# Altium schematic sheet QUTMS-BrakeLight-S00-V00.SchDoc: Brake Light
size A3; DrawnBy: Joseph Richards; DocumentNumber: 1; SheetNumber: 1; SheetTotal: 1
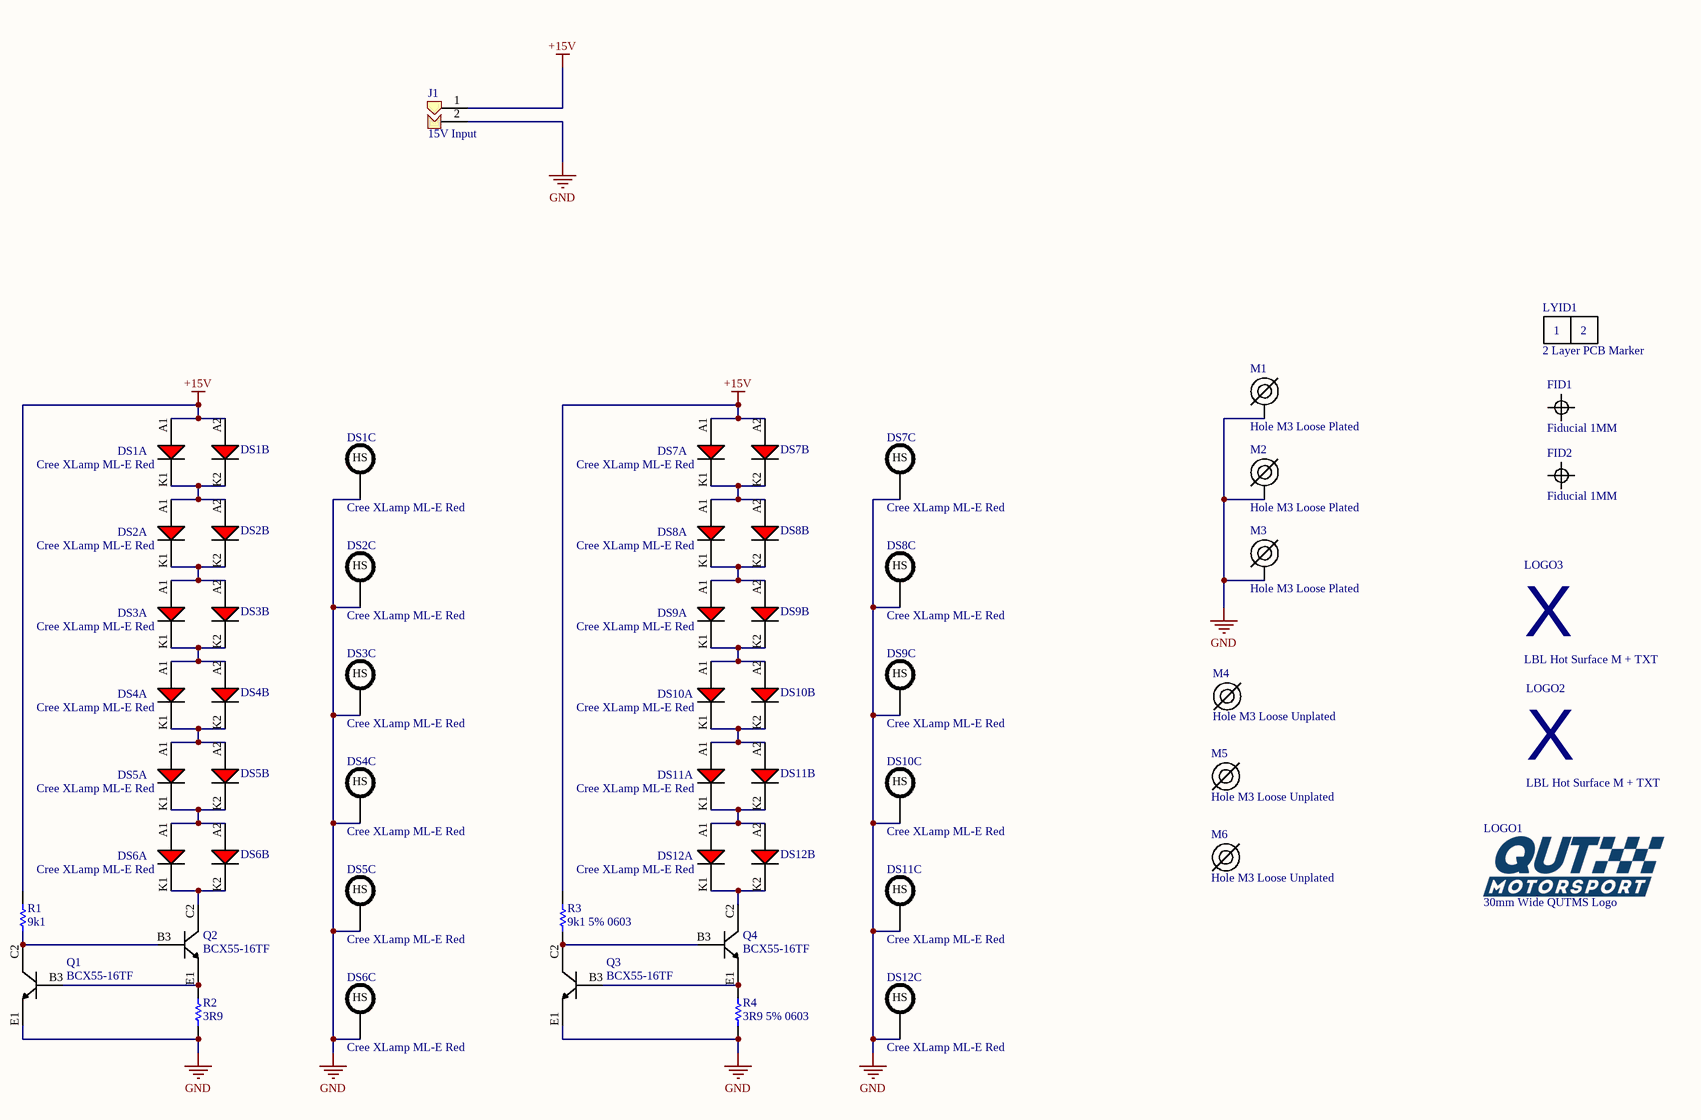
[diagram p0: QUTMS-BrakeLight-S00-V00.SchDoc]

## Parts
DS1  Cree XLamp ML-E Red  [CREE XLAMP ML-E]  (parts A,B,C of 3)
DS2  Cree XLamp ML-E Red  [CREE XLAMP ML-E]  (parts A,B,C of 3)
DS3  Cree XLamp ML-E Red  [CREE XLAMP ML-E]  (parts A,B,C of 3)
DS4  Cree XLamp ML-E Red  [CREE XLAMP ML-E]  (parts A,B,C of 3)
DS5  Cree XLamp ML-E Red  [CREE XLAMP ML-E]  (parts A,B,C of 3)
DS6  Cree XLamp ML-E Red  [CREE XLAMP ML-E]  (parts A,B,C of 3)
DS7  Cree XLamp ML-E Red  [CREE XLAMP ML-E]  (parts A,B,C of 3)
DS8  Cree XLamp ML-E Red  [CREE XLAMP ML-E]  (parts A,B,C of 3)
DS9  Cree XLamp ML-E Red  [CREE XLAMP ML-E]  (parts A,B,C of 3)
DS10  Cree XLamp ML-E Red  [CREE XLAMP ML-E]  (parts A,B,C of 3)
DS11  Cree XLamp ML-E Red  [CREE XLAMP ML-E]  (parts A,B,C of 3)
DS12  Cree XLamp ML-E Red  [CREE XLAMP ML-E]  (parts A,B,C of 3)
FID1  Fiducial 1MM  [FIDUCIAL 1MM]
FID2  Fiducial 1MM  [FIDUCIAL 1MM]
J1  15V Input  [Jumper_2Way_Large_Solder_Pad]
LOGO1  30mm Wide QUTMS Logo  [QUTMS LOGO 30MM]
LOGO2  LBL Hot Surface M + TXT  [LBL HOT MEDIUM TXT]
LOGO3  LBL Hot Surface M + TXT  [LBL HOT MEDIUM TXT]
LYID1  2 Layer PCB Marker  [LAYER IDENT 2]
M1  Hole M3 Loose Plated  [M3.5 PLATED]
M2  Hole M3 Loose Plated  [M3.5 PLATED]
M3  Hole M3 Loose Plated  [M3.5 PLATED]
M4  Hole M3 Loose Unplated  [M3.5 UNPLATED]
M5  Hole M3 Loose Unplated  [M3.5 UNPLATED]
M6  Hole M3 Loose Unplated  [M3.5 UNPLATED]
Q1  BCX55-16TF  [SOT89]
Q2  BCX55-16TF  [SOT89]
Q3  BCX55-16TF  [SOT89]
Q4  BCX55-16TF  [SOT89]
R1  9k1  [Res_ThinFilm_0603]
R2  3R9  [Res_ThinFilm_0603]
R3  9k1 5% 0603  [Res_ThinFilm_0603]
R4  3R9 5% 0603  [Res_ThinFilm_0603]

## Nets
+15V: DS1.A1(A) DS1.A2(A) DS7.A1(A) DS7.A2(A) J1.1 R1.1 R3.1
GND: DS1.HS DS2.HS DS3.HS DS4.HS DS5.HS DS6.HS DS7.HS DS8.HS DS9.HS DS10.HS DS11.HS DS12.HS J1.2 M1.1 M2.1 M3.1 Q1.E1 Q3.E1 R2.1 R4.1
NetDS1_K1: DS1.K1(K) DS1.K2(K) DS2.A1(A) DS2.A2(A)
NetDS2_K1: DS2.K1(K) DS2.K2(K) DS3.A1(A) DS3.A2(A)
NetDS3_K1: DS3.K1(K) DS3.K2(K) DS4.A1(A) DS4.A2(A)
NetDS4_K1: DS4.K1(K) DS4.K2(K) DS5.A1(A) DS5.A2(A)
NetDS5_K1: DS5.K1(K) DS5.K2(K) DS6.A1(A) DS6.A2(A)
NetDS6_K1: DS6.K1(K) DS6.K2(K) Q2.C2
NetDS7_K1: DS7.K1(K) DS7.K2(K) DS8.A1(A) DS8.A2(A)
NetDS8_K1: DS8.K1(K) DS8.K2(K) DS9.A1(A) DS9.A2(A)
NetDS9_K1: DS9.K1(K) DS9.K2(K) DS10.A1(A) DS10.A2(A)
NetDS10_K1: DS10.K1(K) DS10.K2(K) DS11.A1(A) DS11.A2(A)
NetDS11_K1: DS11.K1(K) DS11.K2(K) DS12.A1(A) DS12.A2(A)
NetDS12_K1: DS12.K1(K) DS12.K2(K) Q4.C2
NetQ1_B3: Q1.B3 Q2.E1 R2.2
NetQ1_C2: Q1.C2 Q2.B3 R1.2
NetQ3_B3: Q3.B3 Q4.E1 R4.2
NetQ3_C2: Q3.C2 Q4.B3 R3.2

## Notes on the sheet
- Revision History:
- Sheet Title:
- Rev
- Date
- Description
- Project:
- Size:
- Drawn By:
- A3
- Number:
- Revision:
- Sheet
- Version:
- of
- QUT Motorsport
- O-120, Gardens Point
- 2 George Street
- Brisbane, QLD 4000
- Australia
- Print Date:
- Print Time:
- File Name:
- (in symbol Layer Identification 2) 1; 2
- (in symbol LBL Hot Surface M + TXT) X

## Library data of the parts
DS1-DS12 = Cree XLamp ML-E Red: MLERED-A1-0000-000V01 -  High Brightness LED, XLamp ML-E Series, Red, 630 nm, 125 °, 18.1 lm, 350 mA
J1 = Jumper 2Way Side Large Solder Pad: Jumper 2Way Side Large Solderable Pad
LOGO1 = QUTMS Logo 30mm
LYID1 = Layer Identification 2: 2 Layer Identification PCB Marker
M1-M3 = Hole M3 Loose Plated: M3.5 Hole, Plated
M4-M6 = Hole M3 Loose Unplated: M3.5 Hole, No Plating
Q1-Q4 = BJT NPN Transistor: BCX55-16TF -  Bipolar (BJT) Single Transistor, NPN, 60 V, 155 MHz, 500 mW, 1 A, 100 hFE; ComponentLink1Description: Element14; ComponentLink1URL: https://au.element14.com/nexperia/bcx55-16tf/trans-aec-q101-npn-60v-1a-150deg/dp/3268016
R1 R3 = 9k1 5% 0603: Resistor, SMD, 9k1, 0.1W, 5%, 0603
R2 R4 = 3R9 5% 0603: Resistor, SMD, 3R9, 0.1W, 5%, 0603